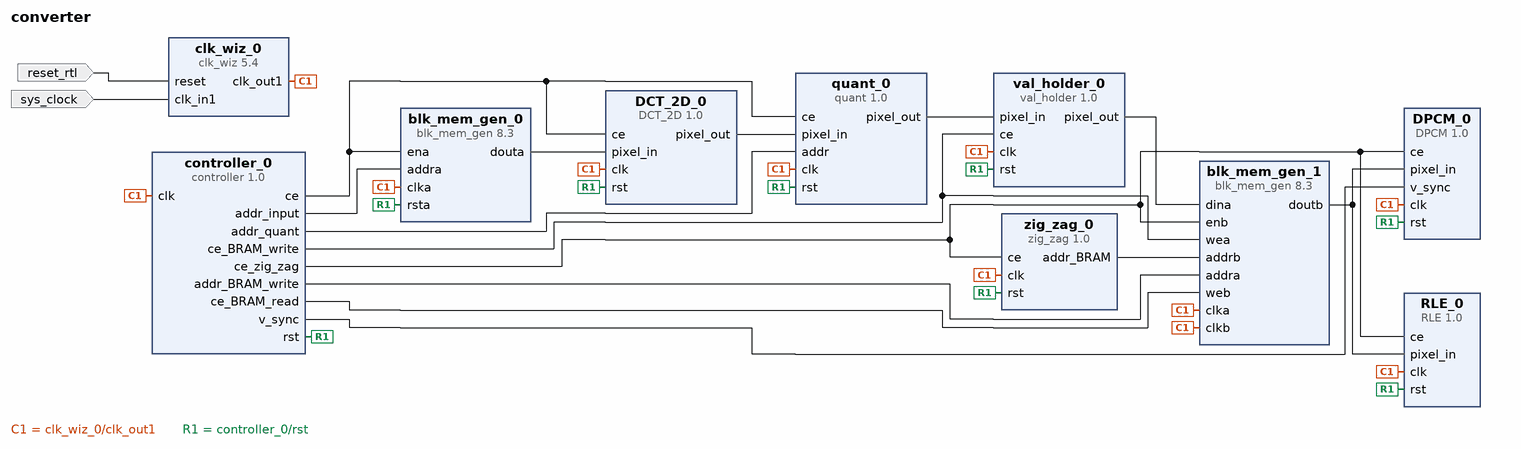
[diagram p0: block diagram of the top level]
# Vivado block design converter, xc7z010clg400-1, Vivado 2017.2
create_bd_design converter

create_bd_port -dir I -type rst reset_rtl
set_property -dict {CONFIG.POLARITY ACTIVE_HIGH} [get_bd_ports reset_rtl]
create_bd_port -dir I -type clk sys_clock
set_property -dict {CONFIG.FREQ_HZ 125000000 CONFIG.PHASE 0.000} [get_bd_ports sys_clock]

create_bd_cell -type ip -vlnv xilinx.com:ip:blk_mem_gen:8.3 blk_mem_gen_0
set_property -dict [list \
  CONFIG.Memory_Type Single_Port_ROM \
  CONFIG.Enable_32bit_Address false \
  CONFIG.Write_Width_A 8 \
  CONFIG.Write_Depth_A 64 \
  CONFIG.Enable_A Use_ENA_Pin \
  CONFIG.Register_PortA_Output_of_Memory_Primitives true \
  CONFIG.Load_Init_File true \
  CONFIG.Coe_File ../../../../../../raw2jpeg.ip_user_files/inputData.coe \
  CONFIG.Use_RSTA_Pin true \
  CONFIG.Port_A_Write_Rate 0 \
  CONFIG.use_bram_block Stand_Alone \
] [get_bd_cells blk_mem_gen_0]
create_bd_cell -type ip -vlnv xilinx.com:ip:blk_mem_gen:8.3 blk_mem_gen_1
set_property -dict [list \
  CONFIG.Memory_Type True_Dual_Port_RAM \
  CONFIG.Enable_32bit_Address false \
  CONFIG.Use_Byte_Write_Enable false \
  CONFIG.Write_Width_A 8 \
  CONFIG.Write_Depth_A 256 \
  CONFIG.Read_Width_A 8 \
  CONFIG.Enable_A Use_ENA_Pin \
  CONFIG.Write_Width_B 8 \
  CONFIG.Read_Width_B 8 \
  CONFIG.Enable_B Use_ENB_Pin \
  CONFIG.Register_PortA_Output_of_Memory_Primitives true \
  CONFIG.Register_PortB_Output_of_Memory_Primitives true \
  CONFIG.Use_RSTA_Pin false \
  CONFIG.Port_B_Clock 100 \
  CONFIG.Port_B_Write_Rate 50 \
  CONFIG.Port_B_Enable_Rate 100 \
  CONFIG.use_bram_block Stand_Alone \
] [get_bd_cells blk_mem_gen_1]
create_bd_cell -type ip -vlnv domain.local:user:DCT_2D:1.0 DCT_2D_0
create_bd_cell -type ip -vlnv domain.local:user:val_holder:1.0 val_holder_0
create_bd_cell -type ip -vlnv xilinx.com:ip:clk_wiz:5.4 clk_wiz_0
set_property -dict [list \
  CONFIG.PRIMITIVE PLL \
  CONFIG.CLKOUT1_DRIVES BUFG \
  CONFIG.CLKOUT2_DRIVES BUFG \
  CONFIG.CLKOUT3_DRIVES BUFG \
  CONFIG.CLKOUT4_DRIVES BUFG \
  CONFIG.CLKOUT5_DRIVES BUFG \
  CONFIG.CLKOUT6_DRIVES BUFG \
  CONFIG.CLKOUT7_DRIVES BUFG \
  CONFIG.USE_LOCKED false \
  CONFIG.MMCM_DIVCLK_DIVIDE 5 \
  CONFIG.MMCM_CLKFBOUT_MULT_F 36 \
  CONFIG.MMCM_CLKIN2_PERIOD 10.0 \
  CONFIG.MMCM_COMPENSATION ZHOLD \
  CONFIG.MMCM_CLKOUT0_DIVIDE_F 9 \
  CONFIG.USE_BOARD_FLOW true \
  CONFIG.CLK_IN1_BOARD_INTERFACE sys_clock \
  CONFIG.CLKOUT1_JITTER 237.312 \
  CONFIG.CLKOUT1_PHASE_ERROR 249.865 \
] [get_bd_cells clk_wiz_0]
create_bd_cell -type ip -vlnv domain.local:user:quant:1.0 quant_0
create_bd_cell -type ip -vlnv domain.local:user:zig_zag:1.0 zig_zag_0
create_bd_cell -type ip -vlnv domain.local:user:RLE:1.0 RLE_0
create_bd_cell -type ip -vlnv domain.local:user:DPCM:1.0 DPCM_0
create_bd_cell -type ip -vlnv domain.local:user:controller:1.0 controller_0

# ---- connections ----

connect_bd_net [get_bd_pins controller_0/addr_quant] [get_bd_pins quant_0/addr]
connect_bd_net [get_bd_pins clk_wiz_0/clk_out1] \
  [get_bd_pins blk_mem_gen_0/clka] [get_bd_pins blk_mem_gen_1/clka] [get_bd_pins DCT_2D_0/clk] [get_bd_pins val_holder_0/clk] \
  [get_bd_pins quant_0/clk] [get_bd_pins blk_mem_gen_1/clkb] [get_bd_pins zig_zag_0/clk] [get_bd_pins RLE_0/clk] \
  [get_bd_pins DPCM_0/clk] [get_bd_pins controller_0/clk]
connect_bd_net [get_bd_pins DCT_2D_0/pixel_out] [get_bd_pins quant_0/pixel_in]
connect_bd_net [get_bd_pins controller_0/rst] \
  [get_bd_pins DCT_2D_0/rst] [get_bd_pins blk_mem_gen_0/rsta] [get_bd_pins val_holder_0/rst] [get_bd_pins quant_0/rst] \
  [get_bd_pins zig_zag_0/rst] [get_bd_pins RLE_0/rst] [get_bd_pins DPCM_0/rst]
connect_bd_net [get_bd_pins controller_0/addr_input] [get_bd_pins blk_mem_gen_0/addra]
connect_bd_net [get_bd_pins blk_mem_gen_0/douta] [get_bd_pins DCT_2D_0/pixel_in]
connect_bd_net [get_bd_pins controller_0/ce_BRAM_write] [get_bd_pins blk_mem_gen_1/wea] [get_bd_pins val_holder_0/ce]
connect_bd_net [get_bd_pins quant_0/pixel_out] [get_bd_pins val_holder_0/pixel_in]
connect_bd_net [get_bd_pins val_holder_0/pixel_out] [get_bd_pins blk_mem_gen_1/dina]
connect_bd_net [get_bd_pins controller_0/ce] [get_bd_pins DCT_2D_0/ce] [get_bd_pins blk_mem_gen_0/ena] [get_bd_pins quant_0/ce]
connect_bd_net [get_bd_pins controller_0/addr_BRAM_write] [get_bd_pins blk_mem_gen_1/addra]
connect_bd_net [get_bd_ports reset_rtl] [get_bd_pins clk_wiz_0/reset]
connect_bd_net [get_bd_ports sys_clock] [get_bd_pins clk_wiz_0/clk_in1]
connect_bd_net [get_bd_pins zig_zag_0/addr_BRAM] [get_bd_pins blk_mem_gen_1/addrb]
connect_bd_net [get_bd_pins controller_0/ce_zig_zag] \
  [get_bd_pins zig_zag_0/ce] [get_bd_pins blk_mem_gen_1/enb] [get_bd_pins RLE_0/ce] [get_bd_pins DPCM_0/ce]
connect_bd_net [get_bd_pins blk_mem_gen_1/doutb] [get_bd_pins RLE_0/pixel_in] [get_bd_pins DPCM_0/pixel_in]
connect_bd_net [get_bd_pins controller_0/ce_BRAM_read] [get_bd_pins blk_mem_gen_1/web]
connect_bd_net [get_bd_pins controller_0/v_sync] [get_bd_pins DPCM_0/v_sync]

validate_bd_design
save_bd_design
